# EAGLE design SortingHat (EAGLE 7.5.0)
REV: 1
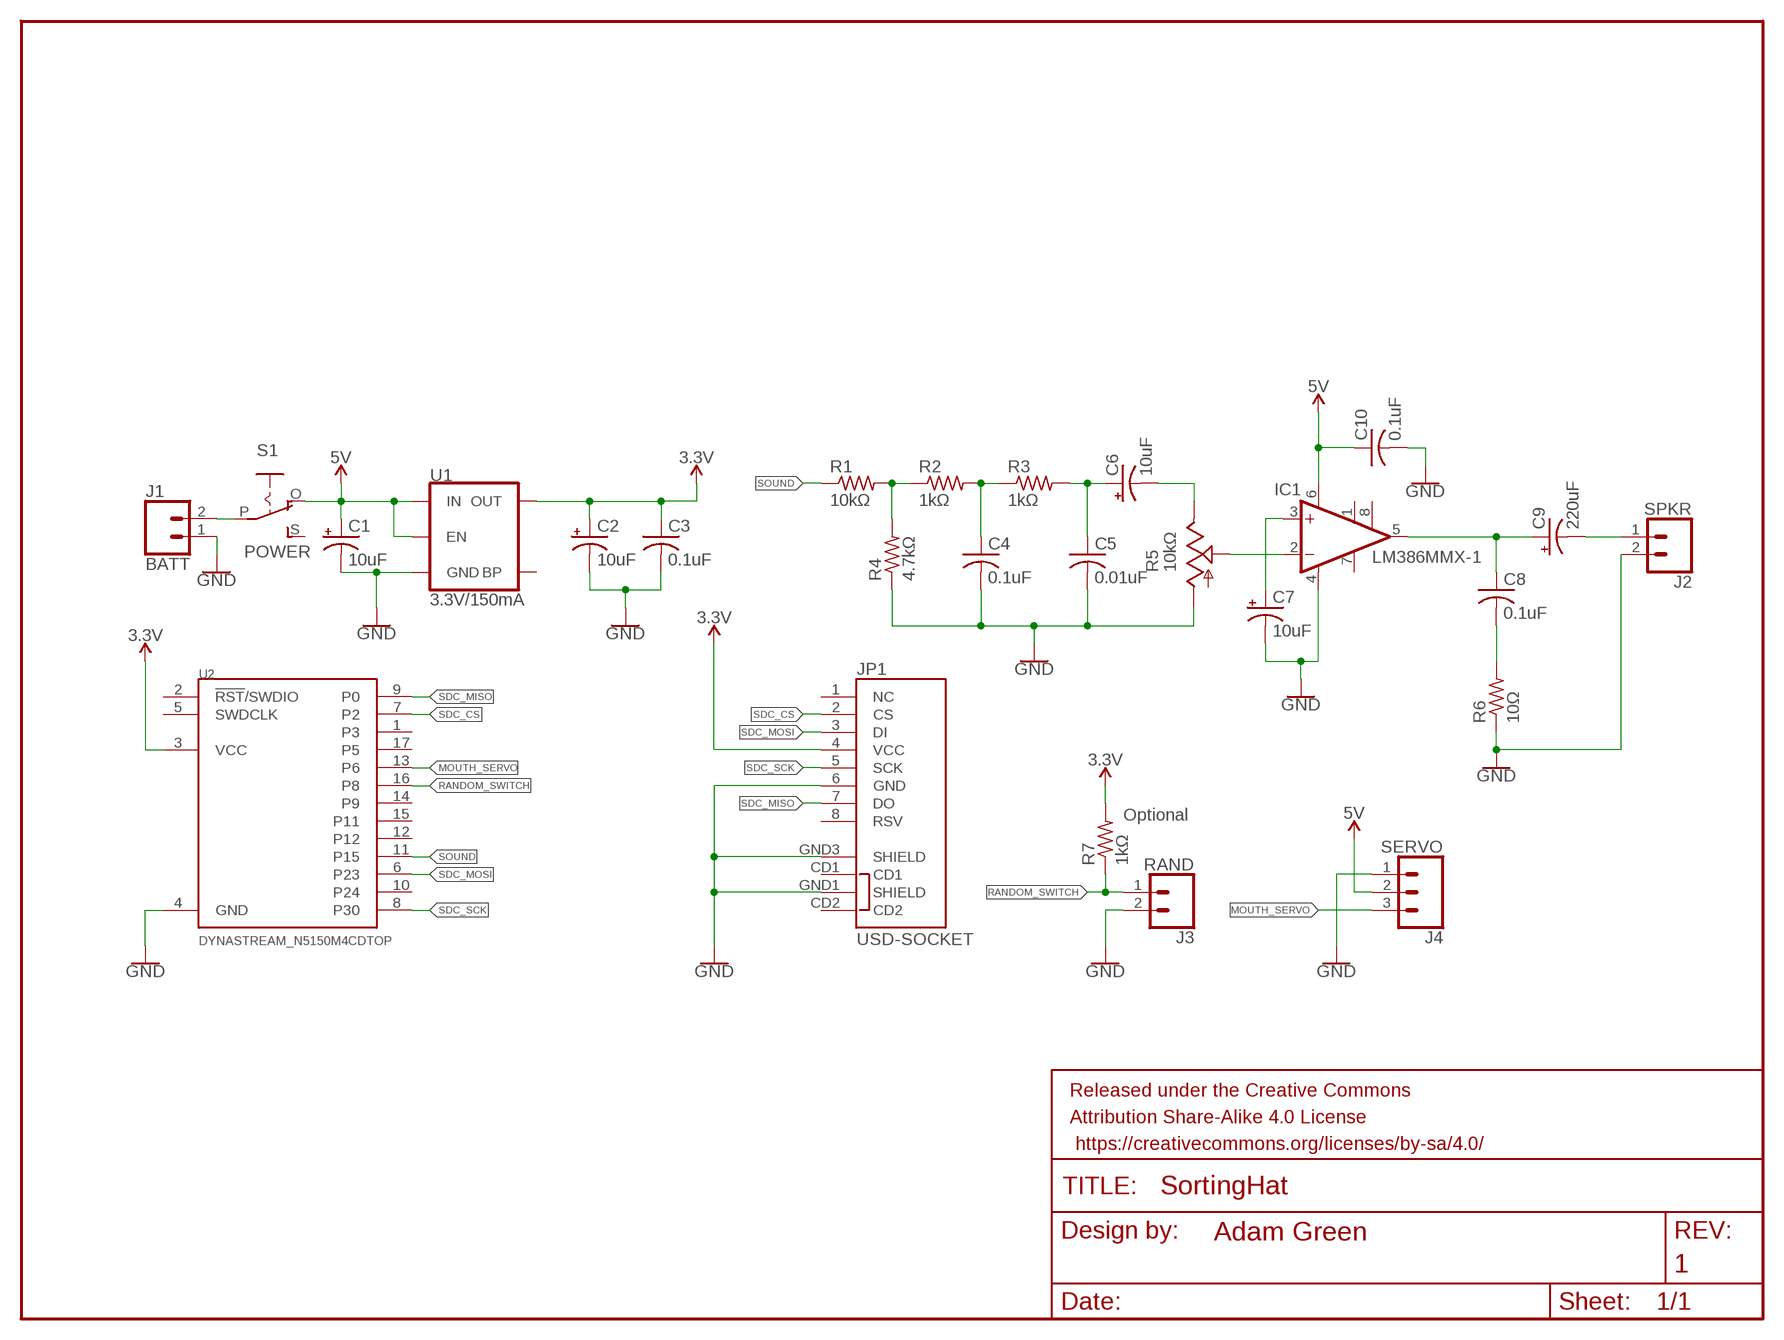
[diagram p0: schematic, sheet 1]

## Parts
C1  10uF  10UF-POLAR-EIA3216-16V-10%(TANT)  [EIA3216]
C2  10uF  10UF-POLAR-EIA3216-16V-10%(TANT)  [EIA3216]
C3  0.1uF  C-USC0805  [C0805]
C4  0.1uF  C-USC0805  [C0805]
C5  0.01uF  C-USC0805  [C0805]
C6  10uF  10UF-POLAR-EIA3216-16V-10%(TANT)  [EIA3216]
C7  10uF  10UF-POLAR-EIA3216-16V-10%(TANT)  [EIA3216]
C8  0.1uF  C-USC0805  [C0805]
C9  220uF  68UF-POLAR-EIA3528-10V-10%(TANT)  [EIA3528]
C10  0.1uF  C-USC0805  [C0805]
FRAME1  FRAME-LETTER  [CREATIVE_COMMONS]
IC1  LM386MMX-1  LM386MM-1  [MMSOP08]
J1  BATT  CONN_021X02_NO_SILK  [1X02_NO_SILK]
J2  SPKR  CONN_021X02_NO_SILK  [1X02_NO_SILK]
J3  RAND  CONN_021X02_NO_SILK  [1X02_NO_SILK]
J4  SERVO  CONN_031X03_NO_SILK  [1X03_NO_SILK]
JP1  USD-SOCKET  [MICROSD_1:1]
R1  10kΩ  R-US_R0805  [R0805]
R2  1kΩ  R-US_R0805  [R0805]
R3  1kΩ  R-US_R0805  [R0805]
R4  4.7kΩ  R-US_R0805  [R0805]
R5  10kΩ  TRIM_US-3223W  [3223W]
R6  10Ω  R-US_R0805  [R0805]
R7  1kΩ  R-US_R0805  [R0805]
S1  POWER  EG1218S  [EG1218]
U1  3.3V/150mA  V_REG_MIC52053.3V  [SOT23-5]
U2  DYNASTREAM_N5150M4CDTOP  [N5150M4CD_TOP]

## Nets
3.3V: C2.+ C3.1 JP1.4(VCC) R7.2 U1.5(OUT) U2.3(VCC)
5V: C1.+ C10.1 IC1.6(VS) J4.2 S1.O U1.1(IN) U1.3(EN)
GND: C1.- C2.- C3.2 C4.2 C5.2 C7.- C10.2 IC1.4(GND) J1.1 J2.2 J3.2 J4.1 JP1.6(GND) JP1.GND1(SHIELD) JP1.GND3(SHIELD) R4.1 R5.1(A) R6.1 U1.2(GND) U2.4(GND)
MOUTH_SERVO: J4.3 U2.13(P6)
N$1: J1.2 S1.P
N$2: R1.2 R2.1 R4.2
N$3: C4.1 R2.2 R3.1
N$4: C5.1 C6.+ R3.2
N$5: C6.- R5.3(E)
N$6: C9.C(-) J2.1
N$7: IC1.2(-IN) R5.2(S)
N$8: C7.+ IC1.3(+IN)
N$10: C8.1 C9.A(+) IC1.5(OUT)
N$11: C8.2 R6.2
RANDOM_SWITCH: J3.1 R7.1 U2.16(P8)
SDC_CS: JP1.2(CS) U2.7(P2)
SDC_MISO: JP1.7(DO) U2.9(P0)
SDC_MOSI: JP1.3(DI) U2.6(P23)
SDC_SCK: JP1.5(SCK) U2.8(P30)
SOUND: R1.1 U2.11(P15)
Unconnected: IC1.1(GAIN) IC1.7(BYPASS) IC1.8(GAIN) JP1.1(NC) JP1.8(RSV) JP1.CD1 JP1.CD2 S1.S U1.4(BP) U2.1(P3) U2.2(!RST!/SWDIO) U2.5(SWDCLK) U2.10(P24) U2.12 U2.14(P9) U2.15(P11) U2.17(P5)

## Notes on the sheet
- Optional

## Library data of the parts
C1 C2 C6 C7 = SparkFun-Capacitors:10UF-POLAR: 10.0µF polarized capacitors A capacitor is a passive two-terminal electrical component used to store electrical energy temporarily in an electric field.; PROD_ID: CAP-00811
C3-C5 C8 C10 = rcl:C-US: CAPACITOR, American symbol
C9 = SparkFun-Capacitors:68UF-POLAR: 68µF polarized capacitors A capacitor is a passive two-terminal electrical component used to store electrical energy temporarily in an electric field.; PROD_ID: CAP-10790; VALUE: 68uF
FRAME1 = SparkFun-Aesthetics:FRAME-LETTER: Schematic Frame - Letter Standard 8.5x11 US Letter frame; DESIGNER: Adam Green; REV: 1
IC1 = linear:LM386?-*: Low Voltage Audio Power Amplifier Source: http://cache.national.com/ds/LM/LM386.pdf
J1-J3 = SparkFun-Connectors:CONN_02: Multi connection point. Often used as Generic Header-pin footprint for 0.1 inch spaced/style header connections On any of the 0.1 inch spaced packages, you can populate with these: Break Away Headers - Straight <https://www.sparkfun.com/products/116> (PRT-00116) Break Away Male Headers - Right Angle <https://www.sparkfun.com/products/553> (PRT-00553) Female Headers <https://www.sparkfun.com/products/115> (PRT-00115) Break Away Headers - Machine Pin <https://www.sparkfun.com/products/117> (PRT-00117) Break Away Female Headers - Swiss Machine Pin <https://www.sparkfun.com/products/743> (PRT-00743) For SCREWTERMINALS and SPRING TERMINALS visit here: Screw Terimnals on SparkFun.com <https://www.sparkfun.com/search/results?term=Screw+Terminals> (5mm/3.5mm/2.54mm spacing) This device is also useful as a general connection point to wire up your design to another part of your project. Our various solder wires solder well into these plated through hole pads. Hook-Up Wire - Assortment (Stranded, 22 AWG) <https://www.sparkfun.com/products/11375> (PRT-11375) Hook-Up Wire - Assortment (Solid Core, 22 AWG) <https://www.sparkfun.com/products/11367> (PRT-11367) View the entire wire category on our website here <https://www.sparkfun.com/categories/141> Special notes: Molex polarized connector foot print use with: PRT-08233 with associated crimp pins and housings. 2.54_SCREWTERM for use with PRT-10571. 3.5mm Screw Terminal footprints for PRT-08084 5mm Screw Terminal footprints for use with PRT-08432
J4 = SparkFun-Connectors:CONN_03: Multi connection point. Often used as Generic Header-pin footprint for 0.1 inch spaced/style header connections On any of the 0.1 inch spaced packages, you can populate with these: Break Away Headers - Straight <https://www.sparkfun.com/products/116> (PRT-00116) Break Away Male Headers - Right Angle <https://www.sparkfun.com/products/553> (PRT-00553) Female Headers <https://www.sparkfun.com/products/115> (PRT-00115) Break Away Headers - Machine Pin <https://www.sparkfun.com/products/117> (PRT-00117) Break Away Female Headers - Swiss Machine Pin <https://www.sparkfun.com/products/743> (PRT-00743) Stackable Header - 3 Pin (Female, 0.1") <https://www.sparkfun.com/products/13875> (PRT-13875) For SCREWTERMINALS and SPRING TERMINALS visit here: Screw Terimnals on SparkFun.com <https://www.sparkfun.com/search/results?term=Screw+Terminals> (5mm/3.5mm/2.54mm spacing) This device is also useful as a general connection point to wire up your design to another part of your project. Our various solder wires solder well into these plated through hole pads. Hook-Up Wire - Assortment (Stranded, 22 AWG) <https://www.sparkfun.com/products/11375> (PRT-11375) Hook-Up Wire - Assortment (Solid Core, 22 AWG) <https://www.sparkfun.com/products/11367> (PRT-11367) View the entire wire category on our website here <https://www.sparkfun.com/categories/141> Special notes: Molex polarized connector foot print use with SKU : PRT-08232 with associated crimp pins and housings.
JP1 = SparkFun-Retired:USD-SOCKET: microSD Socket Push-push type uSD socket. Schematic element and footprint production proven. Spark Fun Electronics SKU : PRT-00127. tDoc lines correctly indicate media card edge positions when inserting (unlocked, locked, depressed). NOTE: CD1 and CD2 are connected internally; PROD_ID: CONN-07820
R1-R4 R6 R7 = rcl:R-US_: RESISTOR, American symbol
R5 = pot:TRIM_US-: POTENTIOMETER
S1 = adafruit:EG1218: SLIDING SWITCH 0.1" spacing through hole, vertical SPDT slide switch http://www.ladyada.net/library/pcb/eaglelibrary.html
U1 = SparkFun-IC-Power:V_REG_MIC5205: V_REG MIC5205 Standard 3.3V, 5V, and Adjustable 150mA LDO voltage regulator in SOT-23 layout. Micrel part MIC5205. BP (by-pass) pin is used to lower output noise with 470pF cap, may be left open. On the adjustable version BP is used to set output.; PROD_ID: VREG-00822
U2 = adam_custom:DYNASTREAM_N5150M4CD

## Board
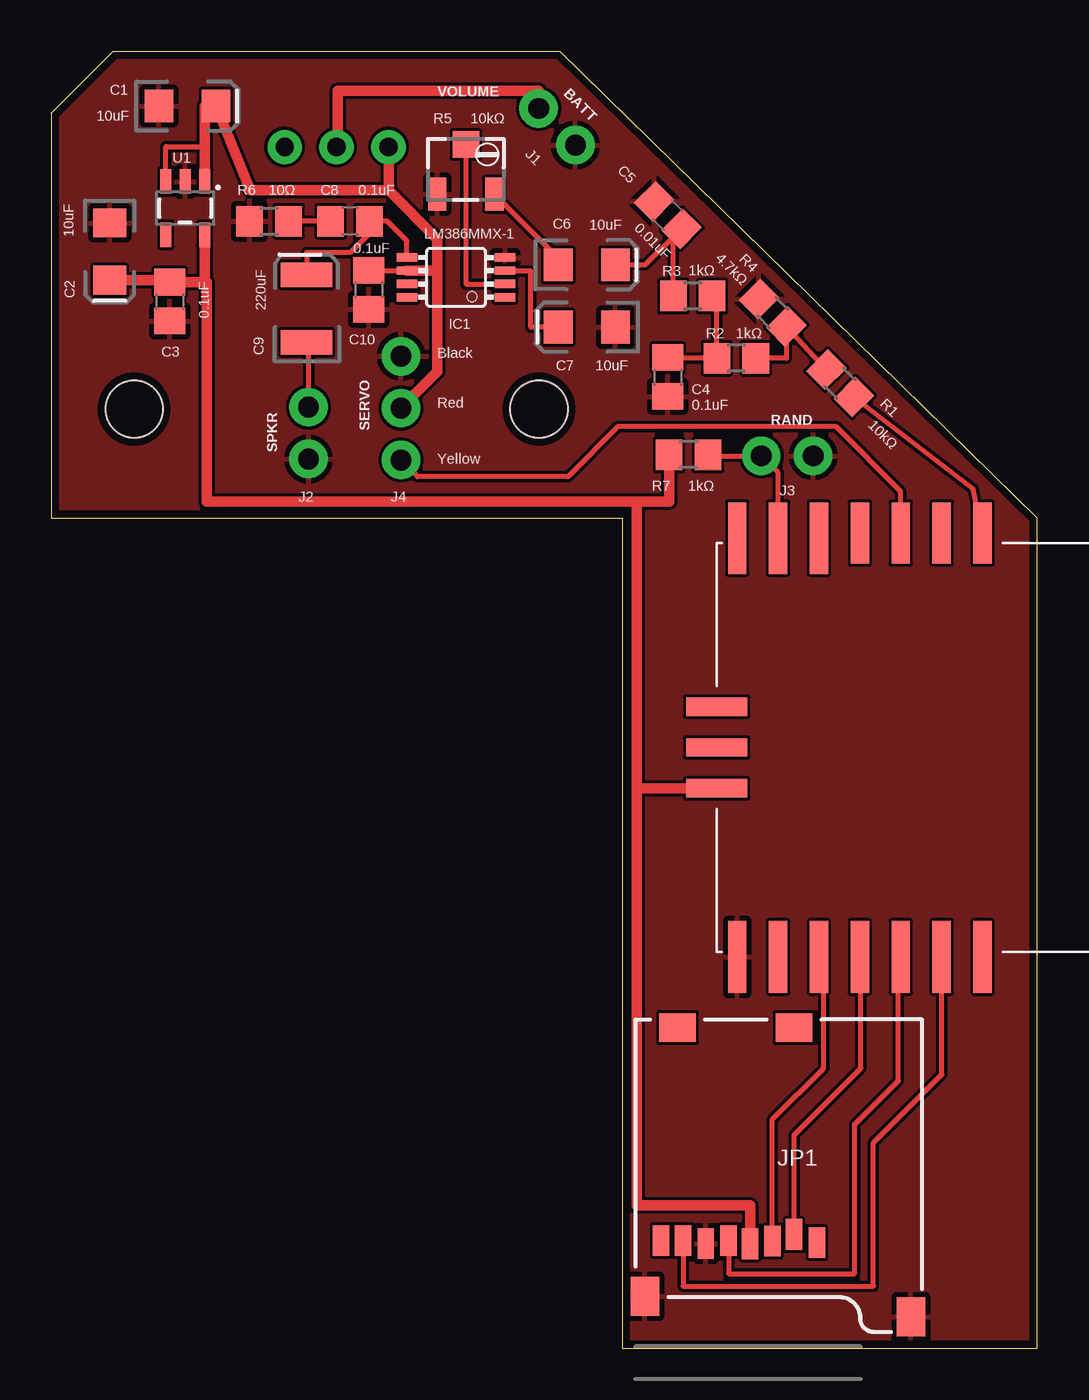
[diagram p1: board, top side]
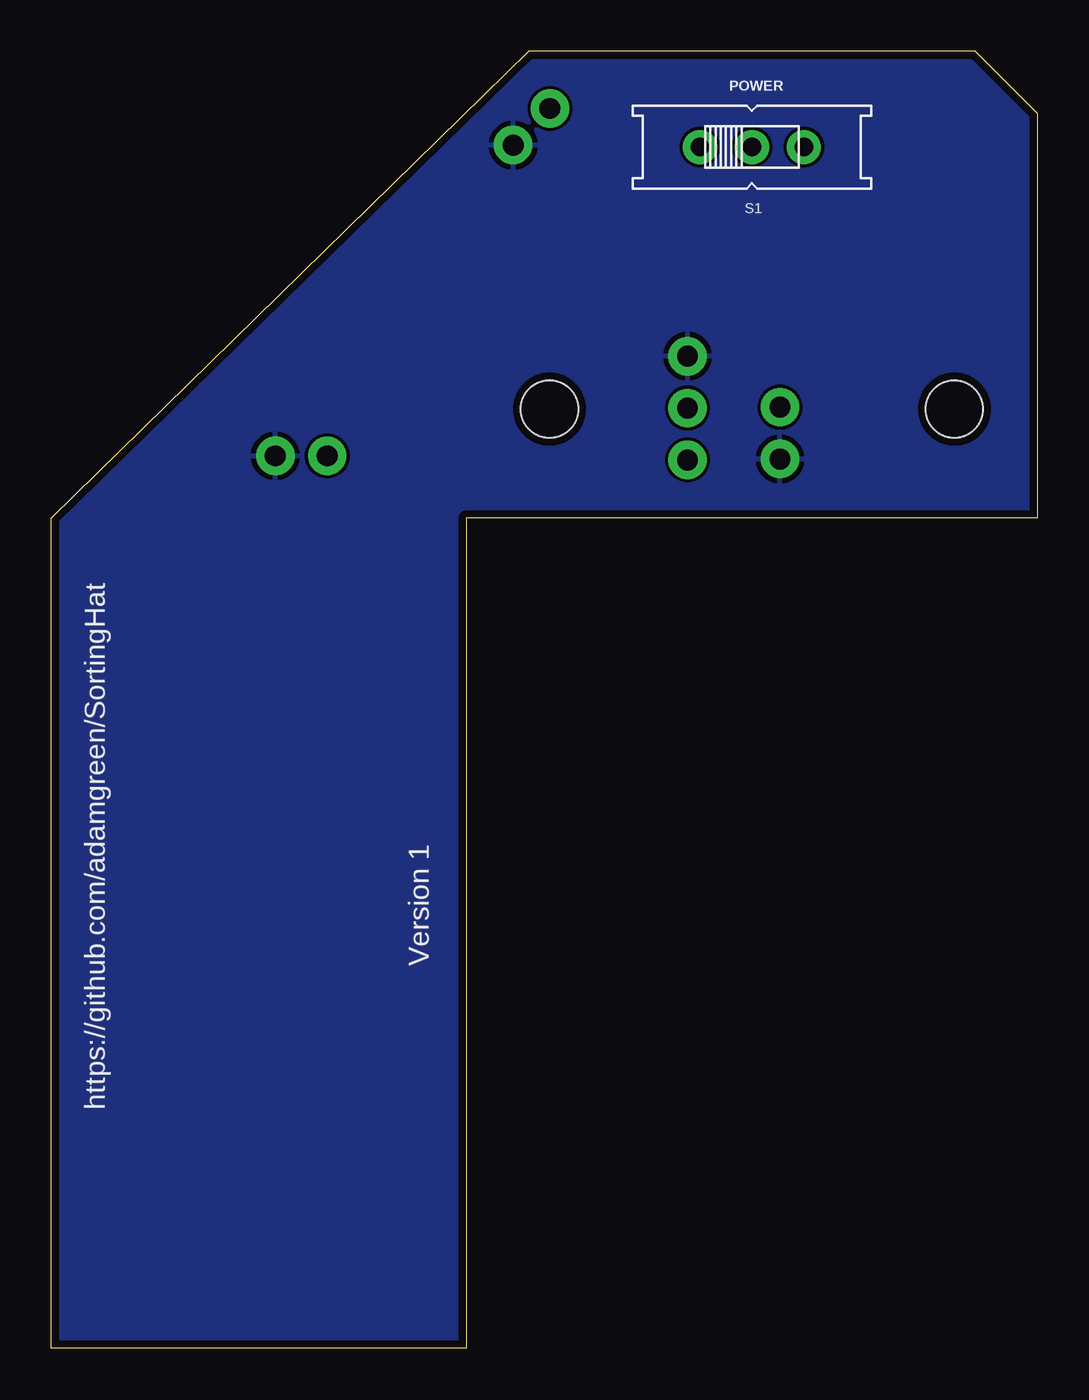
[diagram p2: board, bottom side, seen from below]

Size 48.26 x 63.5 mm. Coordinates in mm from the lower left corner, seen from the top.
Outline: 0,60.45 0,40.64 27.94,40.64 27.94,0 48.26,0 48.26,40.64 24.89,63.5 3.05,63.5 0,60.45
Copper layers (1*16): Top 0.035559375mm / dielectric 1.6mm / Bottom 0.035559375mm
Design rules "oshpark-2layer": minimum track width 6mil, minimum drill 10mil, track to track 6mil, track to pad 6mil, pad to pad 6mil, via to via 6mil, smd to smd 6mil, copper to edge 15mil, drill to drill 6mil, minimum pad ring 5mil, minimum via ring 5mil, stop-mask expansion 2.5mil, vias tented up to drill 0mil, thermal gap 10mil
Holes 2.79 mm at 4.06,45.97 23.88,45.97
tKeepout: area 21.3,43.4 to 26.4,48.5; area 1.5,43.4 to 6.6,48.5
bKeepout: area 1.5,43.4 to 6.6,48.5; area 21.3,43.4 to 26.4,48.5

### Footprints (pad centres in the part's own frame; a part is rotated, then mirrored left to right if it is on the bottom)
EIA3216 = smd 1.4 x 1.6: + 1.4,0; - -1.4,0
C0805 = smd 1.3 x 1.5: 1 -0.95,0; 2 0.95,0
EIA3528 = smd 1.2 x 2.5: A 1.65,0; C -1.65,0
MMSOP08 = smd 0.41 x 1.02: 1 -0.975,-2.4; 2 -0.325,-2.4; 3 0.325,-2.4; 4 0.975,-2.4; 5 0.975,2.4; 6 0.325,2.4; 7 -0.325,2.4; 8 -0.975,2.4
1X02_NO_SILK = drill 1.016 pad 1.88: 1 0,0; 2 2.54,0
1X03_NO_SILK = drill 1.016 pad 1.88: 1 0,0; 2 2.54,0; 3 5.08,0
MICROSD_1:1 = smd 0.8 x 1.5: 1 5.096,10.919; 2 6.218,10.519; 3 7.274,10.853; 4 8.367,10.982; 5 9.421,10.828; 6 10.539,10.973; 7 11.648,10.819; 8 12.721,10.819 | smd 1.8 x 1.4: CD1 11.92,0.4; CD2 6.22,0.4 | smd 1.4 x 1.9: GND1 0.497,14.55; GND3 13.52,13.55
R0805 = smd 1.3 x 1.5: 1 -0.95,0; 2 0.95,0
3223W = smd 0.9 x 1.6: 1 -1.4,-1.215; 3 1.4,-1.215 | smd 1.3 x 1.3: 2 0,1.215
EG1218 = drill 0.9 pad 1.676: O -2.54,0; P 0,0; S 2.54,0
SOT23-5 = smd 0.55 x 1.2: 1 -0.95,-1.3; 2 0,-1.3; 3 0.95,-1.3; 4 0.95,1.3; 5 -0.95,1.3
N5150M4CD_TOP = smd 0.9 x 3: 1 -2,-10; 2 0,-10; 3 2,-10 | smd 3.5 x 0.9: 4 10.25,-9; 5 10.25,-7; 6 10.25,-5; 7 10.25,-3; 8 10.25,-1; 9 10.25,1; 10 10.25,3; 15 -10.25,-5; 16 -10.25,-7; 17 -10.25,-9 | smd 3 x 0.9: 11 -10.5,3; 12 -10.5,1; 13 -10.5,-1; 14 -10.5,-3

### Placement (x,y rotation side)
C1  6.67,60.81 0 top
C2  2.87,53.69 270 top
C3  5.81,51.24 270 top
C4  30.18,47.55 270 top
C5  30.18,55.47 135 top
C6  26.21,53.04 0 top
C7  26.21,49.99 180 top
C8  14.63,55.17 180 top
C9  12.5,50.9 90 top
C10  15.54,51.82 270 top
FRAME1  -101.6,36.83 0 top  (outside the outline)
IC1  19.81,52.43 90 top
J1  25.65,58.9 135 top
J2  12.6,46.08 270 top
J3  34.75,43.69 0 top
J4  17.12,48.56 270 top
JP1  42.57,16.1 180 top
R1  38.61,47.24 135 top
R2  33.53,48.46 180 top
R3  31.39,51.51 180 top
R4  35.31,50.7 315 top
R5  20.29,57.71 0 top
R6  10.67,55.17 0 top
R7  31.19,43.74 180 top
S1  13.97,58.8 0 bottom
U1  6.56,55.81 180 top
U2  42.57,29.41 270 top

### Tracks (layer width: path | path; a pad name or v marks a point on that pad's centre or on a via)
3.3V
  Top 0.508: U2.3 28.65,27.41 | 28.65,27.41 28.65,41.45 | 28.65,41.45 7.62,41.45 7.62,52.19 7.51,52.19 | R7.2 30.24,41.45 28.65,41.45 | JP1.4 34.2,7.01 28.65,7.01 28.65,27.41 | U1.5 7.51,52.19 | 7.51,52.19 C3.1 5.81,52.29 C2.+
5V
  Top 0.254: U1.3 5.61,58.83 7.51,58.83 | C10.1 15.54,52.75 IC1.6
  Top 0.508: S1.O 16.51,56.69 | 16.51,56.69 9.75,56.69 C1.+ 7.51,60.81 7.51,58.83 U1.1 | IC1.6 18.9,52.75 | 18.9,52.75 18.9,54.3 16.51,56.69 | 18.9,52.75 18.9,47.8 J4.2
GND
  pour Bottom: 28.04,0 28.04,40.84 0,40.84 0,60.35 3.05,63.4 24.69,63.4 48.16,40.54 48.16,0
  pour Top: 28.04,0 28.04,40.84 0,40.84 0,60.35 3.05,63.4 24.69,63.4 48.16,40.54 48.16,0
MOUTH_SERVO
  Top 0.254: U2.13 41.57,41.95 38.41,45.11 27.74,45.11 25.3,42.67 17.93,42.67 J4.3
N$1
  Top 0.508: J1.2 23.86,61.57 14.02,61.57 14.02,58.8 S1.P
N$2
  Top 0.254: R1.2 R4.2 35.98,48.46 R2.1
N$3
  Top 0.254: R3.1 32.58,51.51 R2.2 30.18,48.46 C4.1
N$4
  Top 0.254: R3.2 30.44,54.4 C5.1 29.08,53.03 C6.+
N$5
  Top 0.254: C6.- 24.81,53.37 R5.3
N$6
  Top 0.254: J2.1 12.6,49.15 C9.C
N$7
  Top 0.254: R5.2 20.29,52.1 IC1.2
N$8
  Top 0.254: C7.+ 23.47,49.99 23.47,52.73 22.21,52.73 IC1.3
N$10
  Top 0.254: IC1.5 17.41,54.22 16.46,55.17 C8.1 15.58,54.59 14.63,53.65 12.5,53.65 C9.A
N$11
  Top 0.254: C8.2 R6.2
RANDOM_SWITCH
  Top 0.254: R7.1 32.14,43.69 J3.1 35.57,42.87 U2.16
SDC_CS
  Top 0.254: JP1.2 36.35,10.45 39.62,13.72 39.62,19.11 U2.7
SDC_MISO
  Top 0.254: JP1.7 30.92,3.05 40.23,3.05 40.23,10.06 43.59,13.41 43.59,19.15 U2.9
SDC_MOSI
  Top 0.254: JP1.3 35.3,11.22 37.8,13.72 37.8,18.94 U2.6
SDC_SCK
  Top 0.254: JP1.5 33.15,3.66 39.32,3.66 39.32,10.97 41.45,13.11 41.45,19.05 U2.8
SOUND
  Top 0.254: U2.11 45.11,42.06 R1.1

### Text on the board
tPlace: VOLUME | Black | Red | Yellow
bPlace: POWER | https://github.com/adamgreen/SortingHat | Version 1